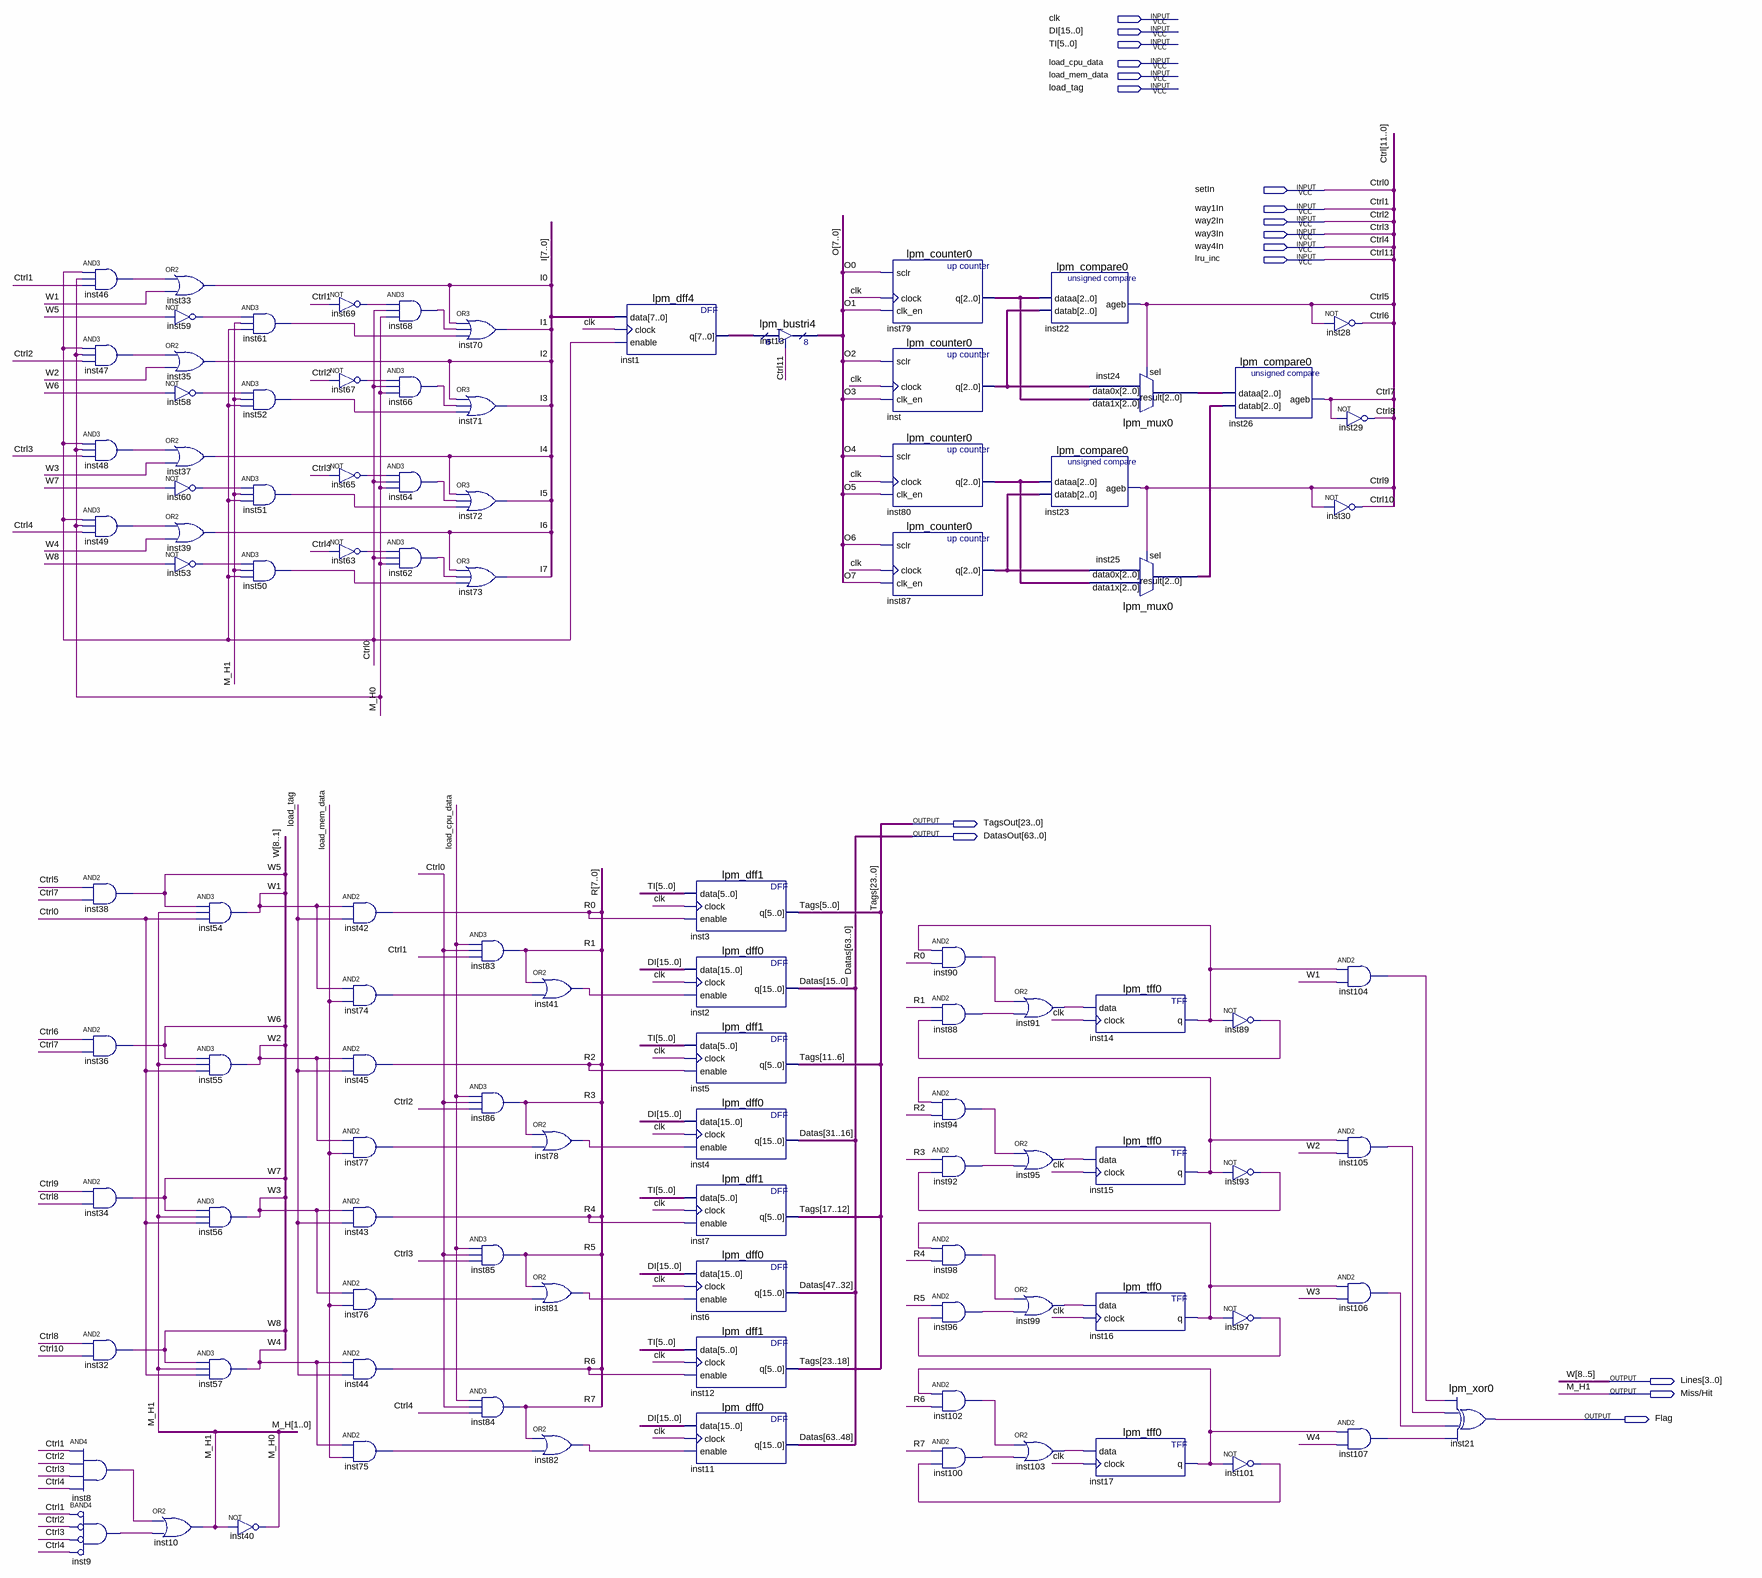
[diagram p0: schematic sheet]
// Quartus schematic Best_Cache_4_way_LRU_element.bdf as structural Verilog: 103 symbols, 17 pins
module Best_Cache_4_way_LRU_element (
  input  clk,
  input  [15:0] DI,
  input  [5:0] TI,
  input  load_cpu_data,
  input  load_mem_data,
  input  load_tag,
  input  setIn,
  input  way1In,
  input  way2In,
  input  way3In,
  input  way4In,
  input  lru_inc,
  output [23:0] TagsOut,
  output [63:0] DatasOut,
  output [3:0] Lines,
  output \Miss/Hit ,
  output Flag
);

  wire inst8_out, inst9_out, inst14_q, inst15_q, inst16_q, inst17_q, inst41_out, inst46_out, inst47_out,
       inst48_out, inst49_out, inst50_out, inst51_out, inst52_out, inst53_out, inst58_out, inst59_out,
       inst60_out, inst61_out, inst62_out, inst63_out, inst64_out, inst65_out, inst66_out, inst67_out,
       inst68_out, inst69_out, inst74_out, inst75_out, inst76_out, inst77_out, inst78_out, inst81_out,
       inst82_out, inst88_out, inst89_out, inst90_out, inst91_out, inst92_out, inst93_out, inst94_out,
       inst95_out, inst96_out, inst97_out, inst98_out, inst99_out, inst100_out, inst101_out, inst102_out,
       inst103_out, inst104_out, inst105_out, inst106_out, inst107_out;
  wire [0:0] M_H;
  wire [2:0] inst24_result, inst25_result, inst79_q, inst80_q, inst87_q, inst_q;
  wire [4:1] W;
  wire [7:0] I, inst1_q, O, R;
  wire [10:5] Ctrl;

  and inst46 (inst46_out, setIn, M_H[0], way1In);
  and inst47 (inst47_out, setIn, M_H[0], way2In);
  and inst48 (inst48_out, setIn, M_H[0], way3In);
  and inst49 (inst49_out, setIn, M_H[0], way4In);
  and inst38 (Lines[0], Ctrl[5], Ctrl[7]);
  and inst36 (Lines[1], Ctrl[6], Ctrl[7]);
  and inst34 (Lines[2], Ctrl[9], Ctrl[8]);
  and inst32 (Lines[3], Ctrl[8], Ctrl[10]);
  and inst8 (inst8_out, way1In, way2In, way3In, way4In);
  and inst9 (inst9_out, ~way1In, ~way2In, ~way3In, ~way4In);  // BAND4
  or inst10 (\Miss/Hit , inst8_out, inst9_out);
  or inst33 (I[0], inst46_out, W[1]);
  not inst59 (inst59_out, Lines[0]);
  or inst35 (I[2], inst47_out, W[2]);
  not inst58 (inst58_out, Lines[1]);
  or inst37 (I[4], inst48_out, W[3]);
  not inst60 (inst60_out, Lines[2]);
  or inst39 (I[6], inst49_out, W[4]);
  not inst53 (inst53_out, Lines[3]);
  and inst54 (W[1], Lines[0], \Miss/Hit , setIn);
  and inst55 (W[2], Lines[1], \Miss/Hit , setIn);
  and inst56 (W[3], Lines[2], \Miss/Hit , setIn);
  and inst57 (W[4], Lines[3], \Miss/Hit , setIn);
  and inst61 (inst61_out, inst59_out, \Miss/Hit , setIn);
  and inst52 (inst52_out, inst58_out, \Miss/Hit , setIn);
  and inst51 (inst51_out, inst60_out, \Miss/Hit , setIn);
  and inst50 (inst50_out, inst53_out, \Miss/Hit , setIn);
  not inst40 (M_H[0], \Miss/Hit );
  not inst69 (inst69_out, way1In);
  not inst67 (inst67_out, way2In);
  not inst65 (inst65_out, way3In);
  not inst63 (inst63_out, way4In);
  and inst42 (R[0], W[1], load_tag);
  and inst74 (inst74_out, W[1], load_mem_data);
  and inst45 (R[2], W[2], load_tag);
  and inst77 (inst77_out, W[2], load_mem_data);
  and inst43 (R[4], W[3], load_tag);
  and inst76 (inst76_out, W[3], load_mem_data);
  and inst44 (R[6], W[4], load_tag);
  and inst75 (inst75_out, W[4], load_mem_data);
  and inst68 (inst68_out, inst69_out, setIn, M_H[0]);
  and inst66 (inst66_out, inst67_out, setIn, M_H[0]);
  and inst64 (inst64_out, inst65_out, setIn, M_H[0]);
  and inst62 (inst62_out, inst63_out, setIn, M_H[0]);
  or inst70 (I[1], I[0], inst68_out, inst61_out);
  or inst71 (I[3], I[2], inst66_out, inst52_out);
  or inst72 (I[5], I[4], inst64_out, inst51_out);
  or inst73 (I[7], I[6], inst62_out, inst50_out);
  and inst83 (R[1], load_cpu_data, setIn, way1In);
  and inst86 (R[3], load_cpu_data, setIn, way2In);
  and inst85 (R[5], load_cpu_data, setIn, way3In);
  and inst84 (R[7], load_cpu_data, setIn, way4In);
  or inst41 (inst41_out, R[1], inst74_out);
  or inst78 (inst78_out, R[3], inst77_out);
  or inst81 (inst81_out, R[5], inst76_out);
  or inst82 (inst82_out, R[7], inst75_out);
  lpm_dff4 inst1 (.data(I), .clock(clk), .enable(setIn), .q(inst1_q));
  lpm_dff1 inst3 (.data(TI), .clock(clk), .enable(R[0]), .q(TagsOut[5:0]));
  lpm_dff0 inst2 (.data(DI), .clock(clk), .enable(inst41_out), .q(DatasOut[15:0]));
  lpm_dff1 inst5 (.data(TI), .clock(clk), .enable(R[2]), .q(TagsOut[11:6]));
  lpm_dff0 inst4 (.data(DI), .clock(clk), .enable(inst78_out), .q(DatasOut[31:16]));
  lpm_dff1 inst7 (.data(TI), .clock(clk), .enable(R[4]), .q(TagsOut[17:12]));
  lpm_dff0 inst6 (.data(DI), .clock(clk), .enable(inst81_out), .q(DatasOut[47:32]));
  lpm_dff1 inst12 (.data(TI), .clock(clk), .enable(R[6]), .q(TagsOut[23:18]));
  lpm_dff0 inst11 (.data(DI), .clock(clk), .enable(inst82_out), .q(DatasOut[63:48]));
  lpm_bustri4 inst13 (.enabledt(lru_inc), .data(inst1_q), .tridata(O));
  lpm_counter0 inst79 (.sclr(O[0]), .clock(clk), .clk_en(O[1]), .q(inst79_q));
  lpm_counter0 inst (.sclr(O[2]), .clock(clk), .clk_en(O[3]), .q(inst_q));
  lpm_counter0 inst80 (.sclr(O[4]), .clock(clk), .clk_en(O[5]), .q(inst80_q));
  lpm_counter0 inst87 (.sclr(O[6]), .clock(clk), .clk_en(O[7]), .q(inst87_q));
  and inst90 (inst90_out, inst14_q, R[0]);
  and inst88 (inst88_out, R[1], inst89_out);
  and inst94 (inst94_out, inst15_q, R[2]);
  and inst92 (inst92_out, R[3], inst93_out);
  and inst98 (inst98_out, inst16_q, R[4]);
  and inst96 (inst96_out, R[5], inst97_out);
  and inst102 (inst102_out, inst17_q, R[6]);
  and inst100 (inst100_out, R[7], inst101_out);
  or inst91 (inst91_out, inst90_out, inst88_out);
  or inst95 (inst95_out, inst94_out, inst92_out);
  or inst99 (inst99_out, inst98_out, inst96_out);
  or inst103 (inst103_out, inst102_out, inst100_out);
  lpm_compare0 inst22 (.dataa(inst79_q), .datab(inst_q), .ageb(Ctrl[5]));
  lpm_compare0 inst23 (.dataa(inst80_q), .datab(inst87_q), .ageb(Ctrl[9]));
  lpm_mux0 inst24 (.data1x(inst79_q), .data0x(inst_q), .sel(Ctrl[5]), .result(inst24_result));
  lpm_mux0 inst25 (.data1x(inst80_q), .data0x(inst87_q), .sel(Ctrl[9]), .result(inst25_result));
  lpm_tff0 inst14 (.data(inst91_out), .clock(clk), .q(inst14_q));
  lpm_tff0 inst15 (.data(inst95_out), .clock(clk), .q(inst15_q));
  lpm_tff0 inst16 (.data(inst99_out), .clock(clk), .q(inst16_q));
  lpm_tff0 inst17 (.data(inst103_out), .clock(clk), .q(inst17_q));
  lpm_compare0 inst26 (.dataa(inst24_result), .datab(inst25_result), .ageb(Ctrl[7]));
  not inst89 (inst89_out, inst14_q);
  not inst93 (inst93_out, inst15_q);
  not inst97 (inst97_out, inst16_q);
  not inst101 (inst101_out, inst17_q);
  not inst28 (Ctrl[6], Ctrl[5]);
  not inst30 (Ctrl[10], Ctrl[9]);
  not inst29 (Ctrl[8], Ctrl[7]);
  and inst104 (inst104_out, inst14_q, W[1]);
  and inst105 (inst105_out, inst15_q, W[2]);
  and inst106 (inst106_out, inst16_q, W[3]);
  and inst107 (inst107_out, inst17_q, W[4]);
  lpm_xor0 inst21 (.data0(inst104_out), .data1(inst105_out), .data2(inst106_out), .data3(inst107_out), .result(Flag));

  // Other names for the same wires on the sheet: Ctrl (some bits) = {lru_inc, way4In, way3In, way2In, way1In, setIn};
  //   Ctrl0 = setIn; Ctrl1 = way1In; Ctrl2 = way2In; Ctrl3 = way3In; Ctrl4 = way4In; Ctrl11 = lru_inc;
  //   Datas[63:0] = DatasOut; M_H[1] = \Miss/Hit ; M_H1 = \Miss/Hit ; Tags[23:0] = TagsOut; W[8:5] = Lines;
  //   W5 = Lines[0]; W6 = Lines[1]; W7 = Lines[2]; W8 = Lines[3]
endmodule
